# Altium schematic sheet POW_Schematic1.SchDoc
size A4
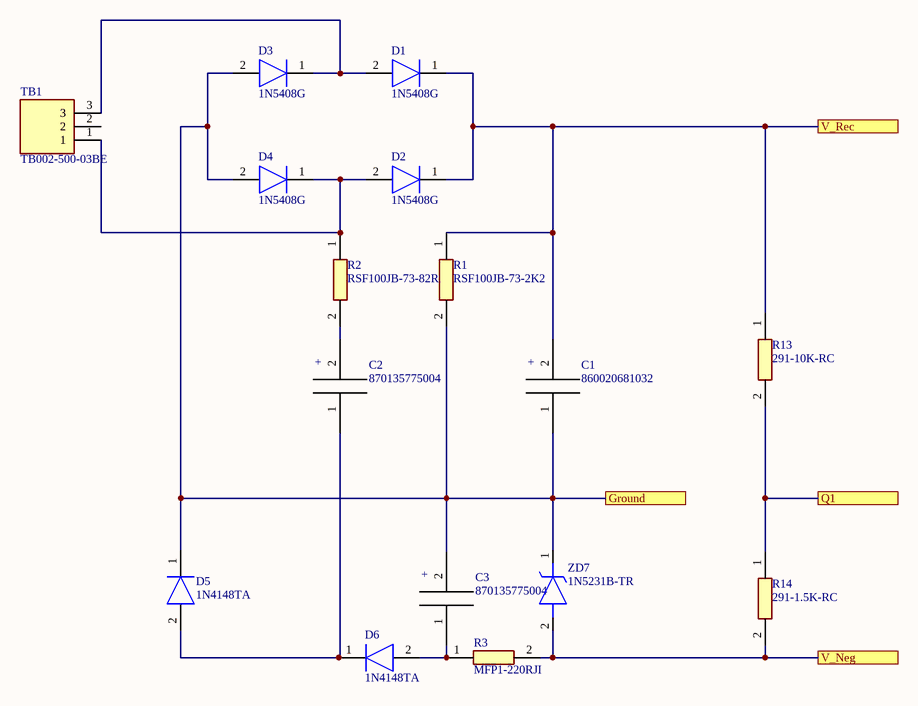
[diagram p0: POW_Schematic1.SchDoc]

## Parts
C1  860020681032  [860020681032]
C2  870135775004  [870135775004]
C3  870135775004  [870135775004]
D1  1N5408G  [DIOAD2860W130L840D505]
D2  1N5408G  [DIOAD2860W130L840D505]
D3  1N5408G  [DIOAD2860W130L840D505]
D4  1N5408G  [DIOAD2860W130L840D505]
D5  1N4148TA  [DIOAD1068W53L380D172]
D6  1N4148TA  [DIOAD1068W53L380D172]
R1  RSF100JB-73-2K2  [RSF100 Style Footprint]
R2  RSF100JB-73-82R  [RSF100 Style Footprint]
R3  MFP1-220RJI  [MFP1-220RJI]
R13  291-10K-RC  [291-XXX-RC-Type]
R14  291-1.5K-RC  [291-XXX-RC-Type]
TB1  TB002-500-03BE  [SHDR3W100P0X500_1X3_1500X760X1000P]
ZD7  1N5231B-TR  [DIOAD990W55L350D160]

## Ports
Ground, Q1, V_Neg, V_Rec

## Nets
Ground: C1.1 C3.2 D3.2(A) D4.2(A) D5.1(K) R1.2 ZD7.1(K) ; port Ground
Q1: R13.2 R14.1 ; port Q1
V_Neg: R3.2 R14.2 ZD7.2(A) ; port V_Neg
V_Rec: C1.2 D1.1(K) D2.1(K) R1.1 R13.1 ; port V_Rec
NetC2_1: C2.1 D5.2(A) D6.1(K)
NetC2_2: C2.2 R2.2
NetC3_1: C3.1 D6.2(A) R3.1
NetD1_2: D1.2(A) D3.1(K) TB1.3
NetD2_2: D2.2(A) D4.1(K) R2.1 TB1.1

Not connected (* = marked no-connect by the designer): TB1 2

## Notes on the sheet
- (in symbol 860020681032) +
- (in symbol 870135775004) +

## Library data of the parts
C1 = 860020681032: Capacitor 3300uF 50V
C2 C3 = 870135775004: Capacitor 47uF 50V
D1-D4 = 1N5408G: Diode; Manufacturer_Name: ON Semiconductor; Allied_Number: 70099678; Datasheet Link: http://www.onsemi.com/pub/Collateral/1N5400-D.PDF; Manufacturer_Part_Number: 1N5408G; Mouser Part Number: 863-1N5408G; Mouser Price/Stock: https://www.mouser.com/Search/Refine.aspx?Keyword=863-1N5408G; RS Part Number: 7743344P; RS Price/Stock: http://uk.rs-online.com/web/p/products/7743344P; Allied Price/Stock: http://www.alliedelec.com/on-semiconductor-1n5408g/70099678/
D5 D6 = 1N4148TA: Diode; Manufacturer_Name: ON Semiconductor; Datasheet Link: https://www.fairchildsemi.com/datasheets/1N/1N914.pdf; Manufacturer_Part_Number: 1N4148TA; Mouser Part Number: 512-1N4148TA; Mouser Price/Stock: https://www.mouser.com/Search/Refine.aspx?Keyword=512-1N4148TA; RS Part Number: 7390290P; RS Price/Stock: http://uk.rs-online.com/web/p/products/7390290P
R1 = RSF100JB-73-2K2: Resistor 1W 2.2K Ohm 5%; Manufacturer_Name: YAGEO (PHYCOMP); Datasheet Link: https://www.mouser.com/datasheet/2/447/Yageo LR_RSF_2013-594715.pdf; Manufacturer_Part_Number: RSF100JB-73-2K2; Mouser Part Number: 603-RSF100JB-73-2K2; Mouser Price/Stock: https://www.mouser.com/Search/Refine.aspx?Keyword=603-RSF100JB-73-2K2
R2 = RSF100JB-73-82R: Resistor 1W 82 Ohm 5%
R3 = MFP1-220RJI: Resistor 220 ohm 5% 1W
TB1 = TB002-500-03BE: Connector; Manufacturer_Name: CUI Devices; Datasheet Link: https://www.cuidevices.com/product/resource/tb002-500.pdf; Height: 10mm; Manufacturer_Part_Number: TB002-500-03BE; Mouser Part Number: 490-TB002-500-03BE; Mouser Price/Stock: https://www.mouser.com/Search/Refine.aspx?Keyword=490-TB002-500-03BE
ZD7 = 1N5231B-TR: Zener Diode; Manufacturer_Name: Vishay; Allied_Number: 70061636; Datasheet Link: http://www.vishay.com/docs/85588/1n5221.pdf; Manufacturer_Part_Number: 1N5231B-TR; Mouser Part Number: 78-1N5231B; Mouser Price/Stock: https://www.mouser.com/Search/Refine.aspx?Keyword=78-1N5231B; RS Part Number: 8115967P; RS Price/Stock: http://uk.rs-online.com/web/p/products/8115967P; Allied Price/Stock: https://www.alliedelec.com/vishay-smallsignal-optoproducts-ssp-1n5231b-tr/70061636/